# EAGLE schematic Xibeca00 (EAGLE 9.6.2)
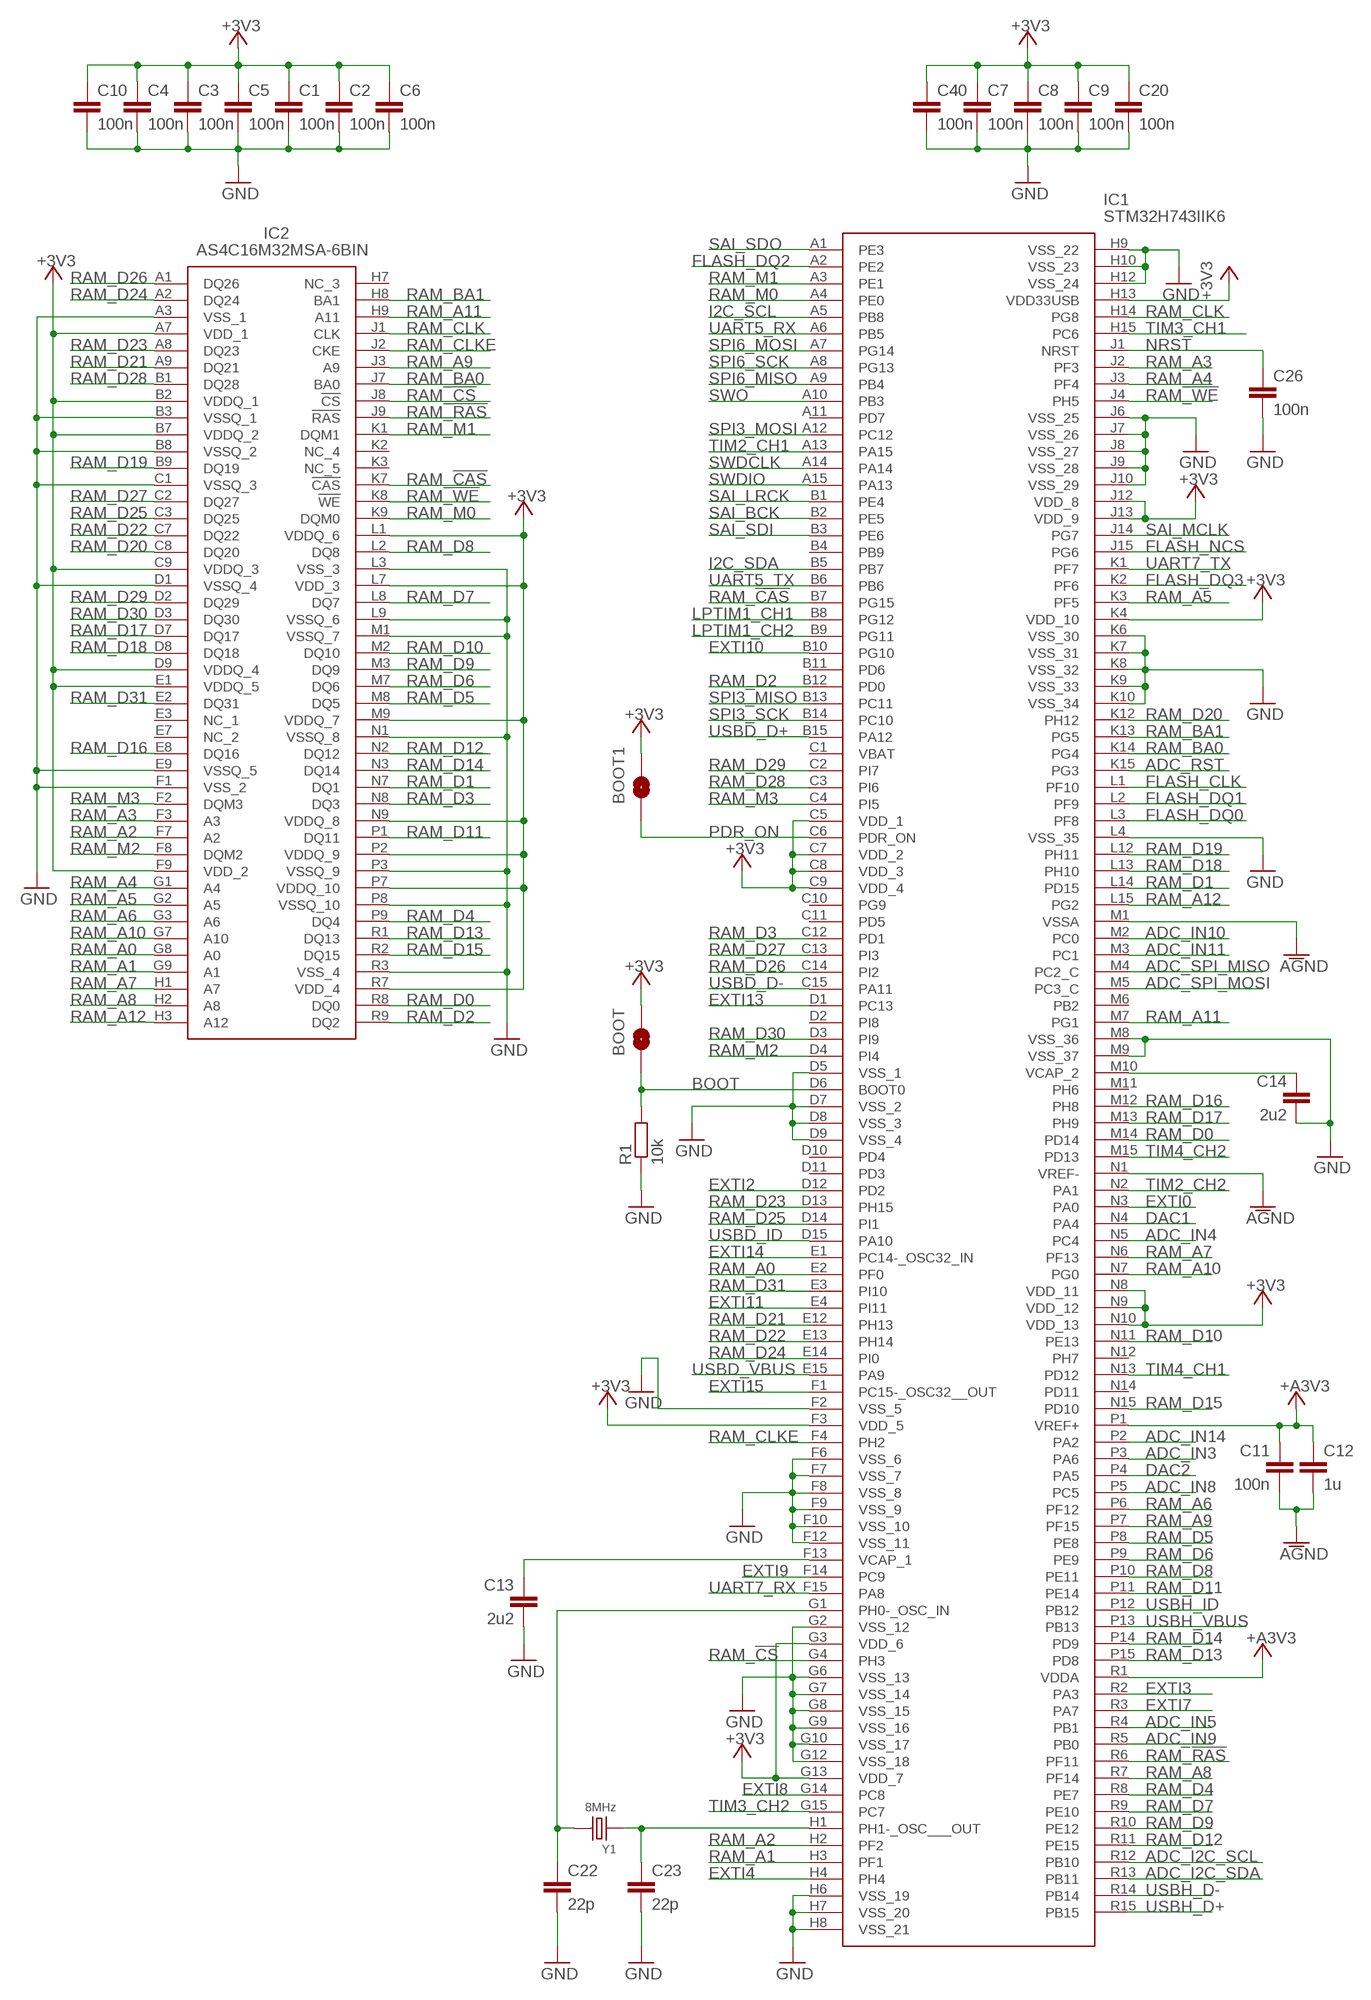
[diagram p0: schematic, sheet 1, part 1 of 2]
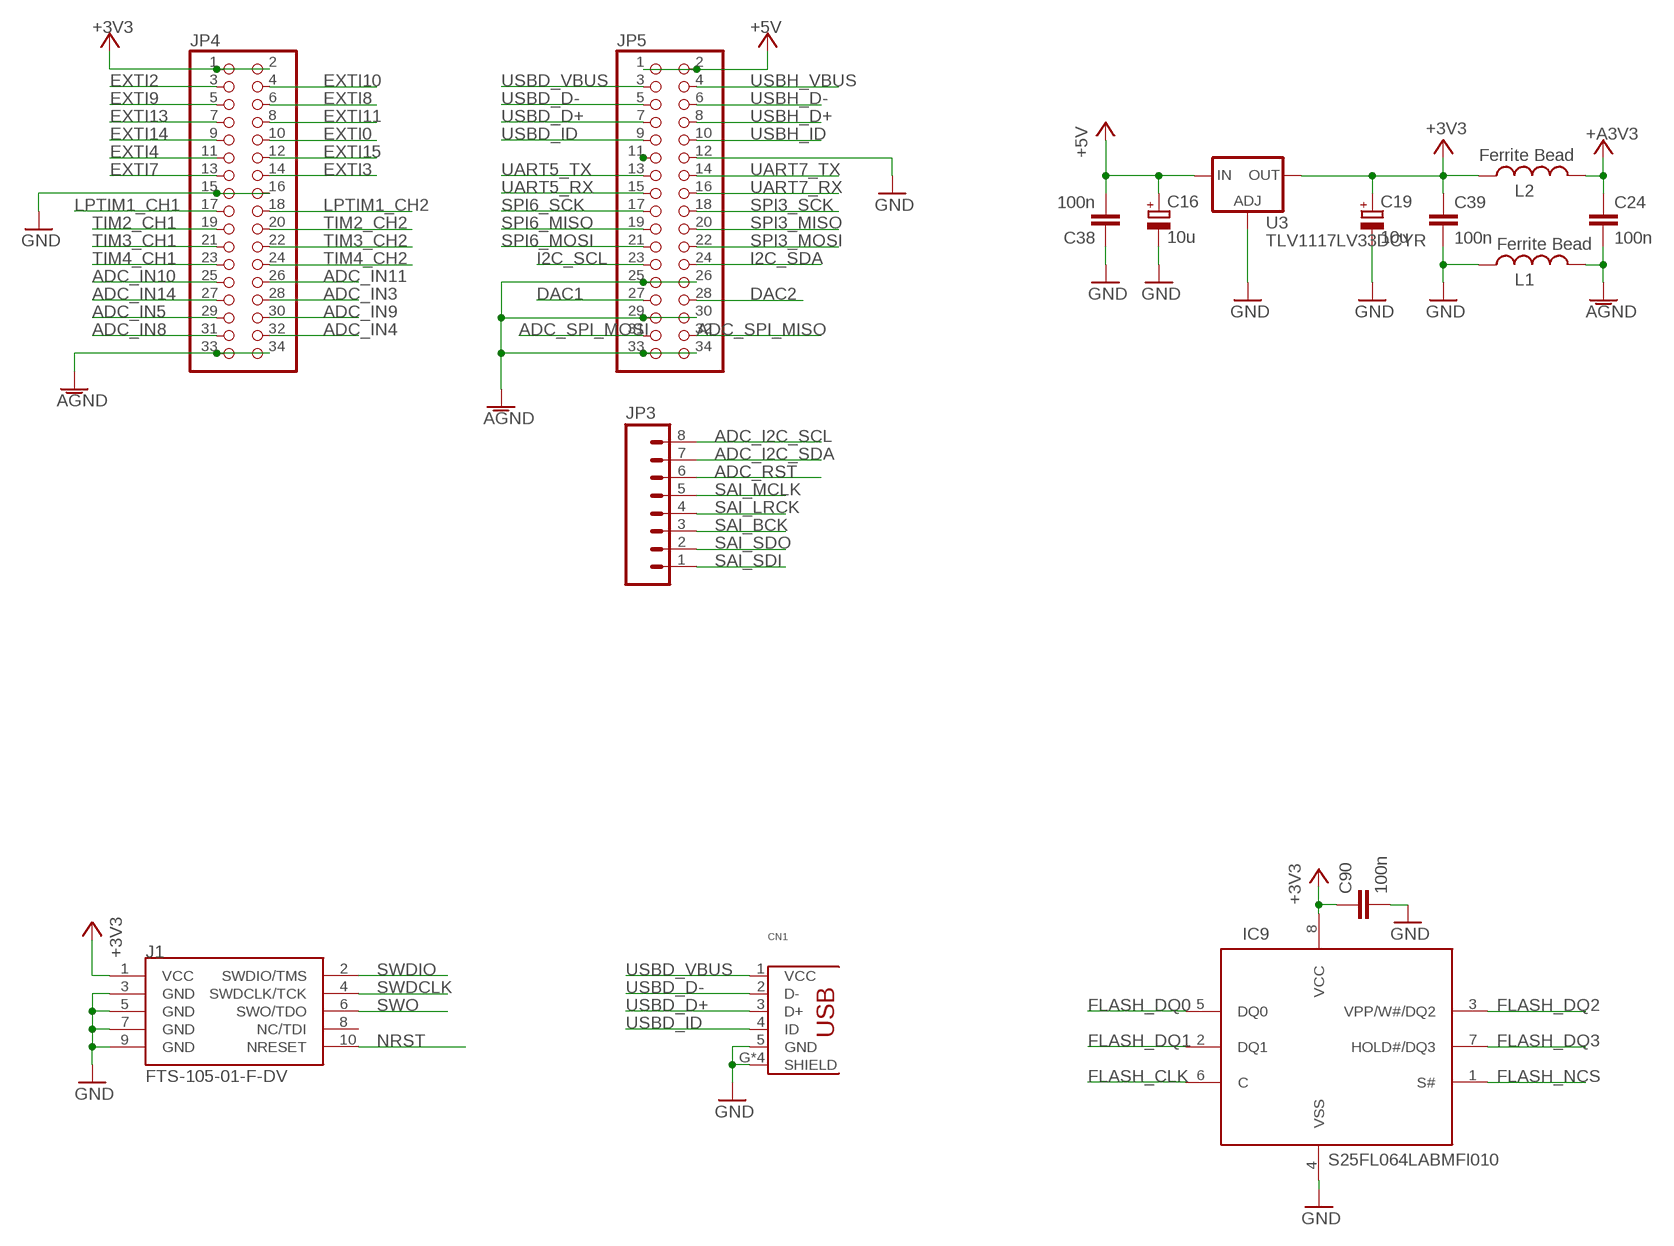
[diagram p1: schematic, sheet 1, part 2 of 2]

## Parts
BOOT  SOLDERJUMPERNO  [SJ_2S-NO]
BOOT1  SOLDERJUMPERNO  [SJ_2S-NO]
C1  100n  C-EUC0402  [C0402]
C2  100n  C-EUC0402  [C0402]
C3  100n  C-EUC0402  [C0402]
C4  100n  C-EUC0402  [C0402]
C5  100n  C-EUC0402  [C0402]
C6  100n  C-EUC0402  [C0402]
C7  100n  C-EUC0402  [C0402]
C8  100n  C-EUC0402  [C0402]
C9  100n  C-EUC0402  [C0402]
C10  100n  C-EUC0402  [C0402]
C11  100n  C-EUC0402  [C0402]
C12  1u  C-EUC0603  [C0603]
C13  2u2  C-EUC0402  [C0402]
C14  2u2  C-EUC0402  [C0402]
C16  10u  CPOL-EUUD-4X5,8  [UD-4X5,8_NICHICON]
C19  10u  CPOL-EUUD-4X5,8  [UD-4X5,8_NICHICON]
C20  100n  C-EUC0402  [C0402]
C22  22p  C-EUC0402  [C0402]
C23  22p  C-EUC0402  [C0402]
C24  100n  C-EUC0402  [C0402]
C26  100n  C-EUC0402  [C0402]
C38  100n  C-EUC0402  [C0402]
C39  100n  C-EUC0402  [C0402]
C40  100n  C-EUC0402  [C0402]
C90  100n  C-EUC0402  [C0402]
CN1  USB_HRS_ZX62-B-5PA(11)MICRO.B  [HRS_ZX62RD-AB-5P8]
IC1  STM32H743IIK6  [BGA201C65P15X15_1000X1000X60]
IC2  AS4C16M32MSA-6BIN  [BGA90C80P9X15_800X1300X100]
IC9  S25FL064LABMFI010  N25Q128A13  [SO8W]
J1  FTS-105-01-F-DV  ARM_10SMD  [2X5_1.27MM_SMD]
JP3  M081X08  [1X08]
JP4  PINHD-2X17  [2X17]
JP5  PINHD-2X17  [2X17]
L1  Ferrite Bead  INDUCTOR  [0603]
L2  Ferrite Bead  INDUCTOR  [0603]
R1  10k  R-EU_R0402  [R0402]
U3  TLV1117LV33DCYR  LD117AS33TR  [SOT223]
Y1  8MHz  SMD-CRYSTAL-8MHZ-20PF-20PPM(2P-5.0X3.2MM)  [X2-SMD-5.0X3.2X1.3MM]

## Nets
+3V3: BOOT1.1 BOOT.1 C1.1 C2.1 C3.1 C4.1 C5.1 C6.1 C7.1 C8.1 C9.1 C10.1 C19.+ C20.1 C39.1 C40.1 C90.1 IC1.C5(VDD_1) IC1.C7(VDD_2) IC1.C8(VDD_3) IC1.C9(VDD_4) IC1.F3(VDD_5) IC1.G3(VDD_6) IC1.G13(VDD_7) IC1.H13(VDD33USB) IC1.J12(VDD_8) IC1.J13(VDD_9) IC1.K4(VDD_10) IC1.N8(VDD_11) IC1.N9(VDD_12) IC1.N10(VDD_13) IC2.A7(VDD_1) IC2.B2(VDDQ_1) IC2.B7(VDDQ_2) IC2.C9(VDDQ_3) IC2.D9(VDDQ_4) IC2.E1(VDDQ_5) IC2.F9(VDD_2) IC2.L1(VDDQ_6) IC2.L7(VDD_3) IC2.M9(VDDQ_7) IC2.N9(VDDQ_8) IC2.P2(VDDQ_9) IC2.P7(VDDQ_10) IC2.R7(VDD_4) IC9.8(VCC) J1.1(VCC) JP4.1 JP4.2 L2.2 U3.4(OUT)
+5V: C16.+ C38.2 JP5.1 JP5.2 U3.3(IN)
+A3V3: C11.1 C12.1 C24.1 IC1.P1(VREF+) IC1.R1(VDDA) L2.1
ADC_I2C_SCL: IC1.R12(PB10) JP3.8
ADC_I2C_SDA: IC1.R13(PB11) JP3.7
ADC_IN3: IC1.P3(PA6) JP4.28
ADC_IN4: IC1.N5(PC4) JP4.32
ADC_IN5: IC1.R4(PB1) JP4.29
ADC_IN8: IC1.P5(PC5) JP4.31
ADC_IN9: IC1.R5(PB0) JP4.30
ADC_IN10: IC1.M2(PC0) JP4.25
ADC_IN11: IC1.M3(PC1) JP4.26
ADC_IN14: IC1.P2(PA2) JP4.27
ADC_RST: IC1.K15(PG3) JP3.6
ADC_SPI_MISO: IC1.M4(PC2_C) JP5.32
ADC_SPI_MOSI: IC1.M5(PC3_C) JP5.31
AGND: C11.2 C12.2 C24.2 IC1.M1(VSSA) IC1.N1(VREF-) JP4.33 JP4.34 JP5.25 JP5.26 JP5.29 JP5.30 JP5.33 JP5.34 L1.1
BOOT: BOOT.2 IC1.D6(BOOT0) R1.2
DAC1: IC1.N4(PA4) JP5.27
DAC2: IC1.P4(PA5) JP5.28
EXTI0: IC1.N3(PA0) JP4.10
EXTI2: IC1.D12(PD2) JP4.3
EXTI3: IC1.R2(PA3) JP4.14
EXTI4: IC1.H4 JP4.11
EXTI7: IC1.R3(PA7) JP4.13
EXTI8: IC1.G14(PC8) JP4.6
EXTI9: IC1.F14(PC9) JP4.5
EXTI10: IC1.B10(PG10) JP4.4
EXTI11: IC1.E4(PI11) JP4.8
EXTI13: IC1.D1(PC13) JP4.7
EXTI14: IC1.E1(PC14-_OSC32_IN) JP4.9
EXTI15: IC1.F1(PC15-_OSC32__OUT) JP4.12
FLASH_CLK: IC1.L1(PF10) IC9.6(C)
FLASH_DQ0: IC1.L3(PF8) IC9.5(DQ0)
FLASH_DQ1: IC1.L2(PF9) IC9.2(DQ1)
FLASH_DQ2: IC1.A2(PE2) IC9.3(VPP/W#/DQ2)
FLASH_DQ3: IC1.K2(PF6) IC9.7(HOLD#/DQ3)
FLASH_NCS: IC1.J15(PG6) IC9.1(S#)
GND: C1.2 C2.2 C3.2 C4.2 C5.2 C6.2 C7.2 C8.2 C9.2 C10.2 C13.2 C14.2 C16.- C19.- C20.2 C22.2 C23.2 C26.2 C38.1 C39.2 C40.2 C90.2 CN1.5(GND) CN1.G2(SHIELD) CN1.G3(SHIELD) CN1.G4(SHIELD) CN1.G(SHIELD) IC1.D5(VSS_1) IC1.D7(VSS_2) IC1.D8(VSS_3) IC1.D9(VSS_4) IC1.F2(VSS_5) IC1.F6(VSS_6) IC1.F7(VSS_7) IC1.F8(VSS_8) IC1.F9(VSS_9) IC1.F10(VSS_10) IC1.F12(VSS_11) IC1.G2(VSS_12) IC1.G6(VSS_13) IC1.G7(VSS_14) IC1.G8(VSS_15) IC1.G9(VSS_16) IC1.G10(VSS_17) IC1.G12(VSS_18) IC1.H6(VSS_19) IC1.H7(VSS_20) IC1.H8(VSS_21) IC1.H9(VSS_22) IC1.H10(VSS_23) IC1.H12(VSS_24) IC1.J6(VSS_25) IC1.J7(VSS_26) IC1.J8(VSS_27) IC1.J9(VSS_28) IC1.J10(VSS_29) IC1.K6(VSS_30) IC1.K7(VSS_31) IC1.K8(VSS_32) IC1.K9(VSS_33) IC1.K10(VSS_34) IC1.L4(VSS_35) IC1.M8(VSS_36) IC1.M9(VSS_37) IC2.A3(VSS_1) IC2.B3(VSSQ_1) IC2.B8(VSSQ_2) IC2.C1(VSSQ_3) IC2.D1(VSSQ_4) IC2.E9(VSSQ_5) IC2.F1(VSS_2) IC2.L3(VSS_3) IC2.L9(VSSQ_6) IC2.M1(VSSQ_7) IC2.N1(VSSQ_8) IC2.P3(VSSQ_9) IC2.P8(VSSQ_10) IC2.R3(VSS_4) IC9.4(VSS) J1.3(GND) J1.5(GND) J1.7(GND) J1.9(GND) JP4.15 JP4.16 JP5.11 JP5.12 L1.2 R1.1 U3.1(ADJ)
I2C_SCL: IC1.A5(PB8) JP5.23
I2C_SDA: IC1.B5(PB7) JP5.24
LPTIM1_CH1: IC1.B8(PG12) JP4.17
LPTIM1_CH2: IC1.B9(PG11) JP4.18
N$1: C14.1 IC1.M10(VCAP_2)
N$11: C13.1 IC1.F13(VCAP_1)
N$12: C23.1 IC1.H1(PH1-_OSC___OUT) Y1.1
N$15: C22.1 IC1.G1(PH0-_OSC_IN) Y1.2
NRST: C26.1 IC1.J1(NRST) J1.10(NRESET)
PDR_ON: BOOT1.2 IC1.C6(PDR_ON)
RAM_!CAS: IC1.B7(PG15) IC2.K7(!CAS)
RAM_!CS: IC1.G4(PH3) IC2.J8(!CS)
RAM_!RAS: IC1.R6(PF11) IC2.J9(!RAS)
RAM_!WE: IC1.J4(PH5) IC2.K8(!WE)
RAM_A0: IC1.E2(PF0) IC2.G8(A0)
RAM_A1: IC1.H3(PF1) IC2.G9(A1)
RAM_A2: IC1.H2(PF2) IC2.F7(A2)
RAM_A3: IC1.J2(PF3) IC2.F3(A3)
RAM_A4: IC1.J3(PF4) IC2.G1(A4)
RAM_A5: IC1.K3(PF5) IC2.G2(A5)
RAM_A6: IC1.P6(PF12) IC2.G3(A6)
RAM_A7: IC1.N6(PF13) IC2.H1(A7)
RAM_A8: IC1.R7(PF14) IC2.H2(A8)
RAM_A9: IC1.P7(PF15) IC2.J3(A9)
RAM_A10: IC1.N7(PG0) IC2.G7(A10)
RAM_A11: IC1.M7(PG1) IC2.H9(A11)
RAM_A12: IC1.L15(PG2) IC2.H3(A12)
RAM_BA0: IC1.K14(PG4) IC2.J7(BA0)
RAM_BA1: IC1.K13(PG5) IC2.H8(BA1)
RAM_CLK: IC1.H14(PG8) IC2.J1(CLK)
RAM_CLKE: IC1.F4(PH2) IC2.J2(CKE)
RAM_D0: IC1.M14(PD14) IC2.R8(DQ0)
RAM_D1: IC1.L14(PD15) IC2.N7(DQ1)
RAM_D2: IC1.B12(PD0) IC2.R9(DQ2)
RAM_D3: IC1.C12(PD1) IC2.N8(DQ3)
RAM_D4: IC1.R8(PE7) IC2.P9(DQ4)
RAM_D5: IC1.P8(PE8) IC2.M8(DQ5)
RAM_D6: IC1.P9(PE9) IC2.M7(DQ6)
RAM_D7: IC1.R9(PE10) IC2.L8(DQ7)
RAM_D8: IC1.P10(PE11) IC2.L2(DQ8)
RAM_D9: IC1.R10(PE12) IC2.M3(DQ9)
RAM_D10: IC1.N11(PE13) IC2.M2(DQ10)
RAM_D11: IC1.P11(PE14) IC2.P1(DQ11)
RAM_D12: IC1.R11(PE15) IC2.N2(DQ12)
RAM_D13: IC1.P15(PD8) IC2.R1(DQ13)
RAM_D14: IC1.P14(PD9) IC2.N3(DQ14)
RAM_D15: IC1.N15(PD10) IC2.R2(DQ15)
RAM_D16: IC1.M12(PH8) IC2.E8(DQ16)
RAM_D17: IC1.M13(PH9) IC2.D7(DQ17)
RAM_D18: IC1.L13(PH10) IC2.D8(DQ18)
RAM_D19: IC1.L12(PH11) IC2.B9(DQ19)
RAM_D20: IC1.K12(PH12) IC2.C8(DQ20)
RAM_D21: IC1.E12(PH13) IC2.A9(DQ21)
RAM_D22: IC1.E13(PH14) IC2.C7(DQ22)
RAM_D23: IC1.D13(PH15) IC2.A8(DQ23)
RAM_D24: IC1.E14(PI0) IC2.A2(DQ24)
RAM_D25: IC1.D14(PI1) IC2.C3(DQ25)
RAM_D26: IC1.C14(PI2) IC2.A1(DQ26)
RAM_D27: IC1.C13(PI3) IC2.C2(DQ27)
RAM_D28: IC1.C3(PI6) IC2.B1(DQ28)
RAM_D29: IC1.C2(PI7) IC2.D2(DQ29)
RAM_D30: IC1.D3(PI9) IC2.D3(DQ30)
RAM_D31: IC1.E3(PI10) IC2.E2(DQ31)
RAM_M0: IC1.A4(PE0) IC2.K9(DQM0)
RAM_M1: IC1.A3(PE1) IC2.K1(DQM1)
RAM_M2: IC1.D4(PI4) IC2.F8(DQM2)
RAM_M3: IC1.C4(PI5) IC2.F2(DQM3)
SAI_BCK: IC1.B2(PE5) JP3.3
SAI_LRCK: IC1.B1(PE4) JP3.4
SAI_MCLK: IC1.J14(PG7) JP3.5
SAI_SDI: IC1.B3(PE6) JP3.1
SAI_SDO: IC1.A1(PE3) JP3.2
SPI3_MISO: IC1.B13(PC11) JP5.20
SPI3_MOSI: IC1.A12(PC12) JP5.22
SPI3_SCK: IC1.B14(PC10) JP5.18
SPI6_MISO: IC1.A9(PB4) JP5.19
SPI6_MOSI: IC1.A7(PG14) JP5.21
SPI6_SCK: IC1.A8(PG13) JP5.17
SWDCLK: IC1.A14 J1.4(SWDCLK/TCK)
SWDIO: IC1.A15(PA13) J1.2(SWDIO/TMS)
SWO: IC1.A10(PB3) J1.6(SWO/TDO)
TIM2_CH1: IC1.A13(PA15) JP4.19
TIM2_CH2: IC1.N2(PA1) JP4.20
TIM3_CH1: IC1.H15(PC6) JP4.21
TIM3_CH2: IC1.G15(PC7) JP4.22
TIM4_CH1: IC1.N13(PD12) JP4.23
TIM4_CH2: IC1.M15(PD13) JP4.24
UART5_RX: IC1.A6(PB5) JP5.15
UART5_TX: IC1.B6 JP5.13
UART7_RX: IC1.F15(PA8) JP5.16
UART7_TX: IC1.K1(PF7) JP5.14
USBD_D+: CN1.3(D+) IC1.B15(PA12) JP5.7
USBD_D-: CN1.2(D-) IC1.C15(PA11) JP5.5
USBD_ID: CN1.4(ID) IC1.D15(PA10) JP5.9
USBD_VBUS: CN1.1(VCC) IC1.E15(PA9) JP5.3
USBH_D+: IC1.R15(PB15) JP5.8
USBH_D-: IC1.R14(PB14) JP5.6
USBH_ID: IC1.P12(PB12) JP5.10
USBH_VBUS: IC1.P13(PB13) JP5.4
Unconnected: IC1.A11(PD7) IC1.B4(PB9) IC1.B11(PD6) IC1.C1(VBAT) IC1.C10(PG9) IC1.C11(PD5) IC1.D2(PI8) IC1.D10(PD4) IC1.D11(PD3) IC1.M6(PB2) IC1.M11(PH6) IC1.N12(PH7) IC1.N14(PD11) IC2.E3(NC_1) IC2.E7(NC_2) IC2.H7(NC_3) IC2.K2(NC_4) IC2.K3(NC_5) J1.8(NC/TDI)

## Library data of the parts
BOOT BOOT1 = SparkFun:SOLDERJUMPER: Solder Jumper Standard SMD solder jumper. Used to automate production. Two varients : Normally Open and Normally Closed are the same, but have different paste layers. NC will have a large amount of paste and should jumper during reflow.
C1-C14 C20 C22-C24 C26 C38-C40 C90 = Rebel:C-EU: CAPACITOR, European symbol
C16 C19 = Rebel:CPOL-EU: POLARIZED CAPACITOR, European symbol
CN1 = Rebel:USB_HRS_ZX62-B-5PA(11)MICRO.B
IC1 = SamacSys_Parts:STM32H743IIK6: STMicroelectronics STM32H743IIK6, 32bit ARM Cortex M7 Microcontroller, 400MHz, 2 MB Flash, 176-Pin UFBGA Source: Datasheet <https://www.st.com/resource/en/datasheet/stm32h743bi.pdf>; ARROW_PART_NUMBER: STM32H743IIK6; ARROW_PRICE-STOCK: https://www.arrow.com/en/products/stm32h743iik6/stmicroelectronics; DESCRIPTION: STMicroelectronics STM32H743IIK6, 32bit ARM Cortex M7 Microcontroller, 400MHz, 2 MB Flash, 176-Pin UFBGA; HEIGHT: 0.6mm; MANUFACTURER_NAME: STMicroelectronics; MANUFACTURER_PART_NUMBER: STM32H743IIK6; MOUSER_PART_NUMBER: 511-STM32H743IIK6; MOUSER_PRICE-STOCK: https://www.mouser.co.uk/ProductDetail/STMicroelectronics/STM32H743IIK6/?qs=YCa%2FAAYMW01oN%252B1CDz2STw%3D%3D
IC2 = SamacSys_Parts:AS4C16M32MSA-6BIN: DRAM 512M 166MHz 16Mx32 Mobile LP SDRAM IT Source: Datasheet <https://componentsearchengine.com/Datasheets/1/AS4C16M32MSA-6BIN.pdf>; DESCRIPTION: DRAM 512M 166MHz 16Mx32 Mobile LP SDRAM IT; HEIGHT: 1mm; MANUFACTURER_NAME: Alliance Memory; MANUFACTURER_PART_NUMBER: AS4C16M32MSA-6BIN; MOUSER_PART_NUMBER: 913-AS4C16M32MSA6BIN; MOUSER_PRICE-STOCK: https://www.mouser.co.uk/ProductDetail/Alliance-Memory/AS4C16M32MSA-6BIN/?qs=rrS6PyfT74ddF3cG4TAQxg%3D%3D
IC9 = Rebel:N25Q128A13: N25Q128A13 Flash Memory SO8W; OC_FARNELL: 2253682
J1 = borkedlabs-connectors:ARM_10; PACKAGE: 2x5_1.27MM_SMD
JP3 = SparkFun:M08: Header 8 Standard 8-pin 0.1" header. Use with straight break away headers (SKU : PRT-00116), right angle break away headers (PRT-00553), swiss pins (PRT-00743), machine pins (PRT-00117), and female headers (PRT-00115).
JP4 JP5 = pinhead:PINHD-2X17: PIN HEADER
L1 L2 = Rebel:INDUCTOR; OC_FARNELL: 2288736
R1 = Rebel:R-EU_: RESISTOR, European symbol
U3 = v-reg:LD117A?*: Low drop fixed and adjustable positive voltage regulators 1 A Source: http://www.st.com/stonline/products/literature/ds/7194/ld1117axx.pdf
Y1 = Seeed-OPL-crystal-osctllator:SMD-CRYSTAL-8MHZ-20PF-20PPM(2P-5.0X3.2MM): 306010004; MPN: 5032/2P; VALUE: 5032/2p

## Net classes
1 power: width 0.178 mm, drill 0.305 mm, clearance 0.178 mm to class 0, clearance 0.178 mm